# EAGLE design espnative-deadrail-2-c (EAGLE 7.6.0)
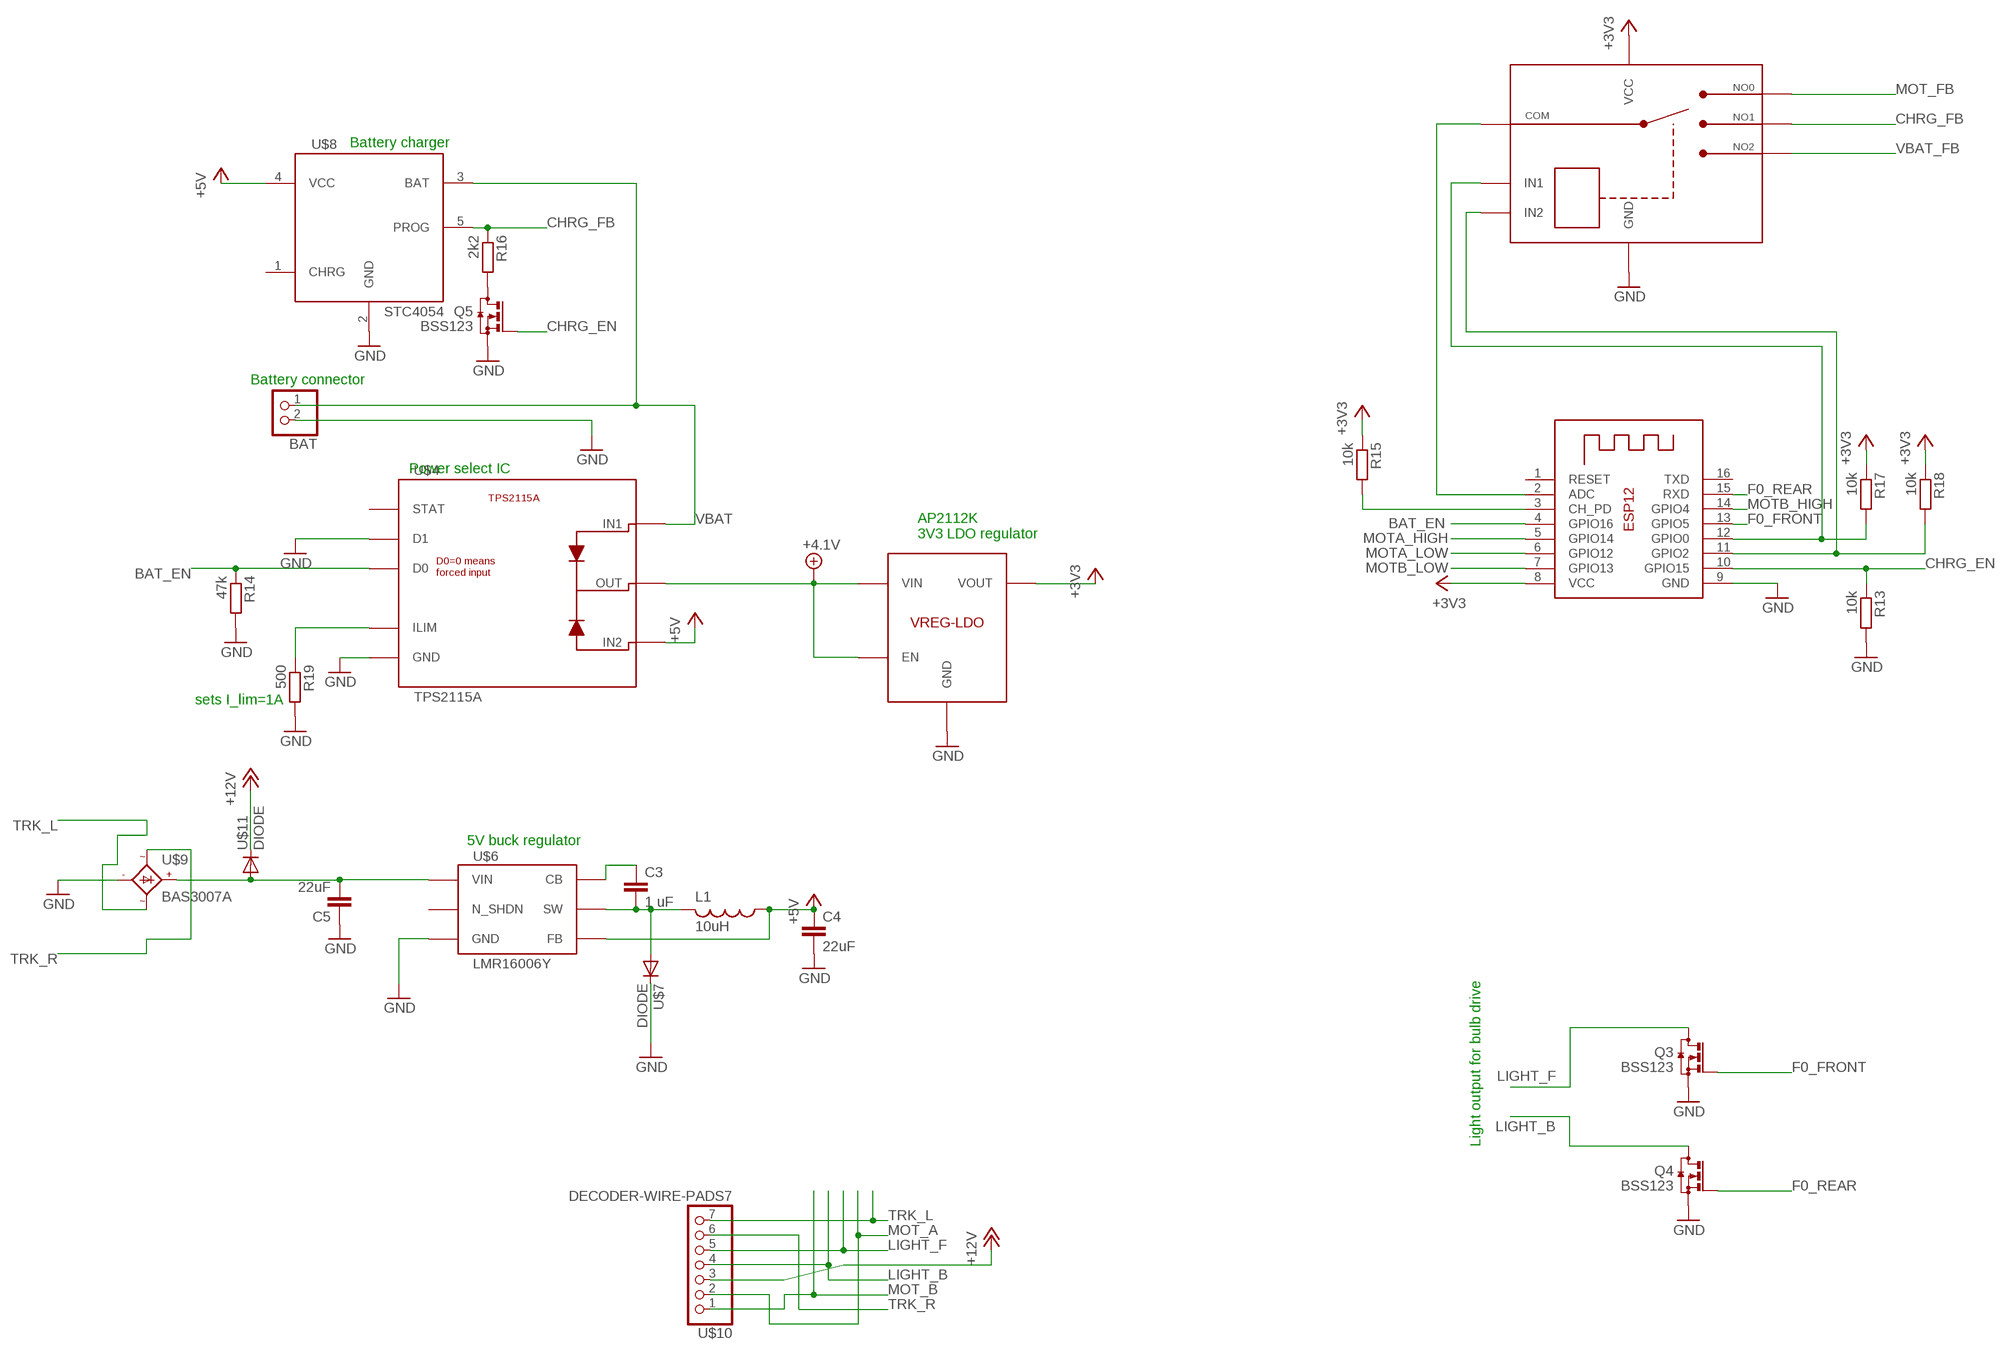
[diagram p0: schematic, sheet 1, part 1 of 2]
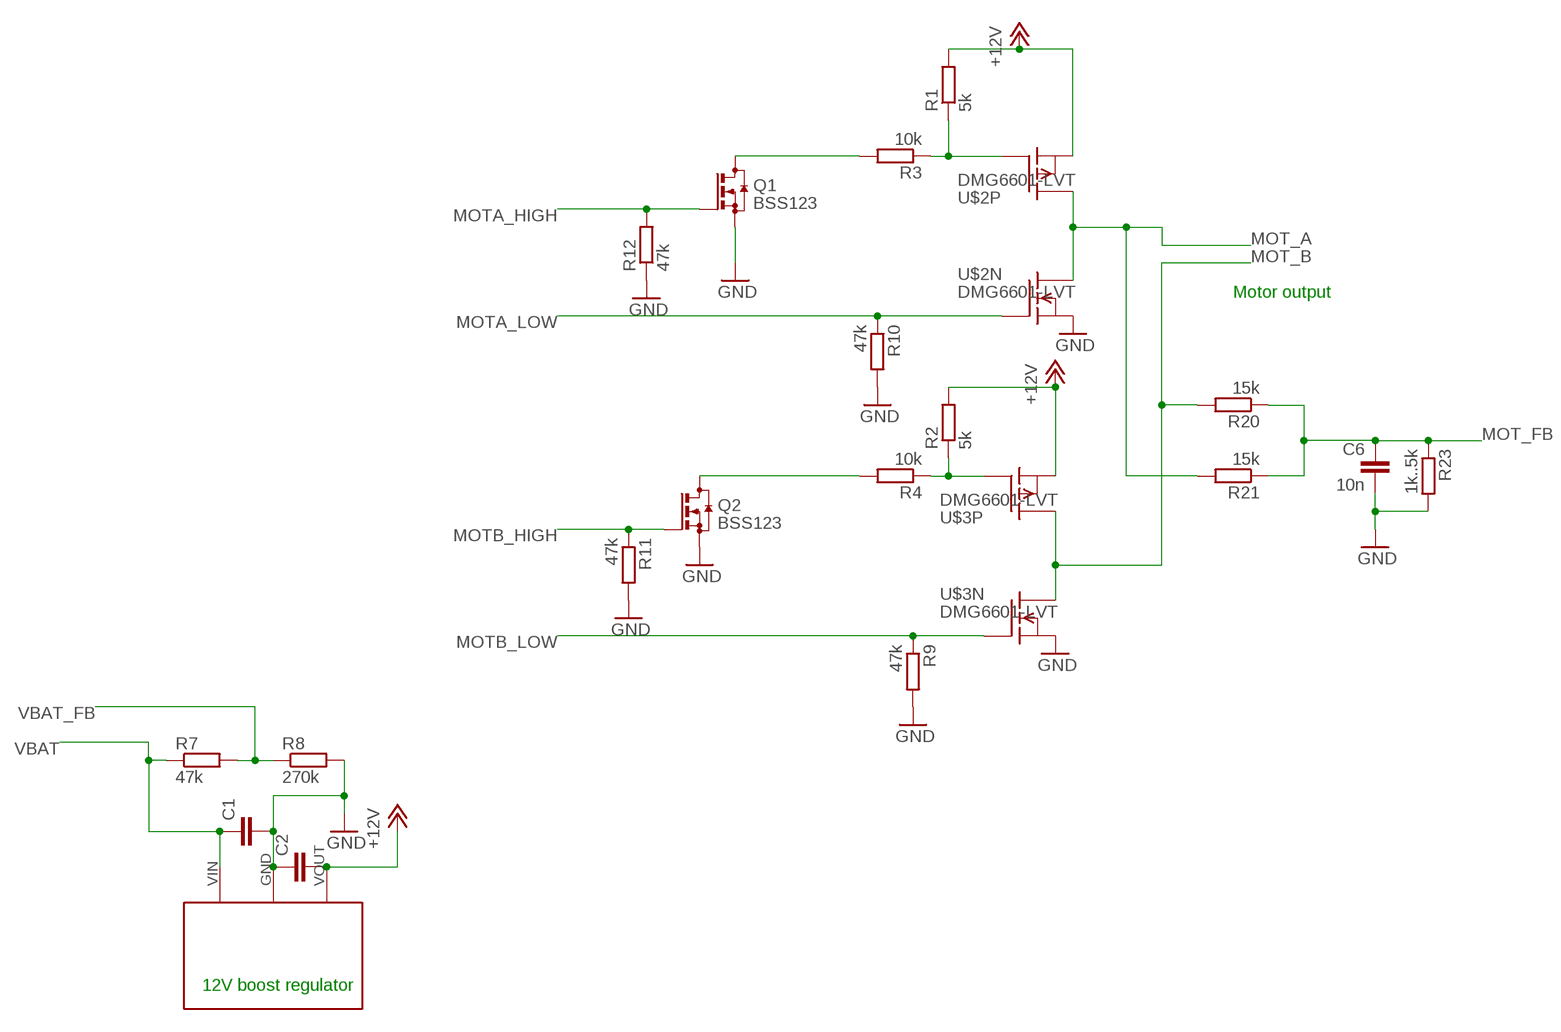
[diagram p1: schematic, sheet 1, part 2 of 2]

## Parts
BAT  JST_2PIN-SMT-RA  [JST-PH-2-SMT-RA]
C1  C-EUC1206  [C1206]
C2  C-EUC1206  [C1206]
C3  1 uF  C-EUC0603  [C0603]
C4  22uF  C-EUC0603  [C0603]
C5  22uF  C-EUC1206  [C1206]
C6  10n  C-EUC0603  [C0603]
L1  10uH  FDSD0420  [FDSD0420]
Q1  BSS123  [SOT23]
Q2  BSS123  [SOT23]
Q3  BSS123  [SOT23]
Q4  BSS123  [SOT23]
Q5  BSS123  [SOT23]
R1  5k  R-EU_R0603  [R0603]
R2  5k  R-EU_R0603  [R0603]
R3  10k  R-EU_R0603  [R0603]
R4  10k  R-EU_R0603  [R0603]
R7  47k  R-EU_R0603  [R0603]
R8  270k  R-EU_R0603  [R0603]
R9  47k  R-EU_R0603  [R0603]
R10  47k  R-EU_R0603  [R0603]
R11  47k  R-EU_R0603  [R0603]
R12  47k  R-EU_R0603  [R0603]
R13  10k  R-EU_R0603  [R0603]
R14  47k  R-EU_R0603  [R0603]
R15  10k  R-EU_R0603  [R0603]
R16  2k2  R-EU_R0603  [R0603]
R17  10k  R-EU_R0603  [R0603]
R18  10k  R-EU_R0603  [R0603]
R19  500  R-EU_R0603  [R0603]
R20  15k  R-EU_R0603  [R0603]
R21  15k  R-EU_R0603  [R0603]
R23  1k..5k  R-EU_R0603  [R0603]
U$1  AP2112K-3V3  AP2112K  [SOT23-5L]
U$2  DMG6601-LVT  [TSOT-26]
U$3  DMG6601-LVT  [TSOT-26]
U$4  TPS2115A  [TSSOP-8]
U$5  POLOLU-VREG12  [POLOLU-REGULATOR]
U$6  LMR16006Y  [SOT23-6]
U$7  DIODE  [DIODE-1206]
U$8  STC4054  [SOT23-5L]
U$9  BAS3007A  [SOT143B]
U$10  DECODER-WIRE-PADS7  [DECODER-WIRE-PADS]
U$11  DIODE  [DIODE-1206]
U$12  TS5A3359  [US8]
X1  ESP-12  [ESP-12]

## Nets
+3V3: R15.1 R17.1 R18.1 U$1.5(VOUT) U$12.8(VCC) X1.8(VCC)
+4.1V: U$1.1(VIN) U$1.3(EN) U$4.7(OUT)
+5V: C4.1 L1.P$1 U$4.6(IN2) U$6.3(FB) U$8.4(VCC)
+12V: C2.2 R1.2 R2.2 U$2.2(P:S) U$3.2(P:S) U$5.VOUT U$10.3 U$11.C
BAT_EN: R14.1 U$4.2(D0) X1.4(GPIO16)
CHRG_EN: Q5.1(G) R13.1 X1.10(GPIO15)
CHRG_FB: R16.1 U$8.5(PROG) U$12.2(NO1)
DCC_VPLUS: C5.2 U$6.5(VIN) U$9.4(+) U$11.A
F0_FRONT: Q3.1(G) X1.13(GPIO5)
F0_REAR: Q4.1(G) X1.15(RXD)
GND: BAT.2 C1.2 C2.1 C4.2 C5.1 C6.2 Q1.2(S) Q2.2(S) Q3.2(S) Q4.2(S) Q5.2(S) R8.2 R9.2 R10.2 R11.2 R12.1 R13.2 R14.2 R19.2 R23.2 U$1.2(GND) U$2.5(N:S) U$3.5(N:S) U$4.3(D1) U$4.5(GND) U$5.GND U$6.2(GND) U$7.C U$8.2(GND) U$9.1(-) U$12.4(GND) X1.9(GND)
LIGHT_B: Q4.3(D) U$10.4
LIGHT_F: Q3.3(D) U$10.5
MOT_A: R21.2 U$2.4(P:D) U$2.6(N:D) U$10.2
MOT_B: R20.2 U$3.4(P:D) U$3.6(N:D) U$10.1
MOT_FB: C6.1 R20.1 R21.1 R23.1 U$12.1(NO0)
MOTA_HIGH: Q1.1(G) R12.2 X1.5(GPIO14)
MOTA_LOW: R10.1 U$2.1(N:G) X1.6(GPIO12)
MOTB_HIGH: Q2.1(G) R11.1 X1.14(GPIO4)
MOTB_LOW: R9.1 U$3.1(N:G) X1.7(GPIO13)
N$1: U$12.7(COM) X1.2(ADC)
N$2: R1.1 R3.1 U$2.3(P:G)
N$3: Q2.3(D) R4.2
N$4: R2.1 R4.1 U$3.3(P:G)
N$5: C3.2 L1.P$2 U$6.6(SW) U$7.A
N$6: Q1.3(D) R3.2
N$8: C3.1 U$6.1(CB)
N$11: Q5.3(D) R16.2
N$12: R17.2 U$12.6(IN1) X1.12(GPIO0)
N$17: R15.2 X1.3(CH_PD)
N$20: R18.2 U$12.5(IN2) X1.11(GPIO2)
N$22: R19.1 U$4.4(ILIM)
TRK_L: U$9.3(AC2) U$10.7
TRK_R: U$9.2(AC1) U$10.6
VBAT: BAT.1 C1.1 R7.1 U$4.8(IN1) U$5.VIN U$8.3(BAT)
VBAT_FB: R7.2 R8.1 U$12.3(NO2)
Unconnected: U$4.1(STAT) U$6.4(N_SHDN) U$8.1(CHRG) X1.1(RESET) X1.16(TXD)

## Notes on the sheet
- Battery charger
- Battery connector
- Power select IC
- AP2112K
  3V3 LDO regulator
- Motor output
- sets I_lim=1A
- 5V buck regulator
- Light output for bulb drive
- 12V boost regulator

## Library data of the parts
BAT = adafruit:JST_2PIN: JST 2-Pin Connectors of various flavors SMT-RA (S2B-PH-SM4) 4UConnector #17311 SMT (B2B-PH-SM4) THM-RA (S2B-PH) THM (B2B-PH)
C1-C6 = rcl:C-EU: CAPACITOR, European symbol
L1 = trainlib:FDSD0420
Q1-Q5 = transistor-small-signal:BSS123: N-CHANNEL MOS FET
R1-R4 R7-R21 R23 = rcl:R-EU_: RESISTOR, European symbol
U$1 = trainlib:AP2112: 600mA CMOS LDO regulator with enable http://www.diodes.com/_files/datasheets/AP2112.pdf http://www.digikey.com/product-detail/en/diodes-incorporated/AP2112K-3.3TRG1/AP2112K-3.3TRG1DICT-ND/4505257 Package includes sot23-5.
U$2 U$3 = trainlib:DMG6601-LVT: Dual N+P-channel MOSFET. Package: TSOT-26 Vmax=30V N-channel: 55mOhm, 3.8A Imax P-channel: 110mOhm, 2.5A Imax
U$4 = trainlib:TPS2115A: Power source select Ideal diode pair selects power source from two alternatives. Truth table: D0=0 selects fixed input. (D1=0 sleects IN2, D1=1 selects IN1) D0=1 selects auto-input. (D1=0 picks higher voltage, D1=1 sets shutdown) http://www.ti.com/lit/ds/symlink/tps2114a.pdf
U$5 = trainlib:POLOLU-VREG12
U$6 = trainlib:LMR16006Y: Buck regulator with 600mA output current and 2.1MHz fixed frequency. http://www.ti.com/lit/ds/symlink/lmr16006y-q1.pdf Available in sot23-6 package.
U$7 U$11 = trainlib:DIODE
U$8 = trainlib:STC4054: Single-cell Li-ion battery charger Configurable maximum current Lithium battery charger. The maximum charging current can be configured with a resistor, up to 800 mA. Charge can be enabled or inhibited. http://www.st.com/content/ccc/resource/technical/document/datasheet/df/b9/e6/5b/ec/92/45/ed/CD00132951.pdf/files/CD00132951.pdf/jcr:content/translations/en.CD00132951.pdf
U$9 = trainlib:BAS3007A: Bridge rectifier 30V typical voltage loss 0.5V, current capability up to 0.9A datasheet link <http://www.infineon.com/dgdl/bas3007aseries.pdf?folderId=db3a304313d846880113def5812204a1&fileId=db3a3043156fd5730115a286aa19083b>
U$10 = trainlib:DECODER-WIRE-PADS7
U$12 = trainlib:TS5A3359: SP3T analog mux 1-Ohm 3-way multiplexer, controlled by two input lines. http://www.ti.com/lit/ds/symlink/ts5a3359.pdf
X1 = adafruit:ESP-12

## Board
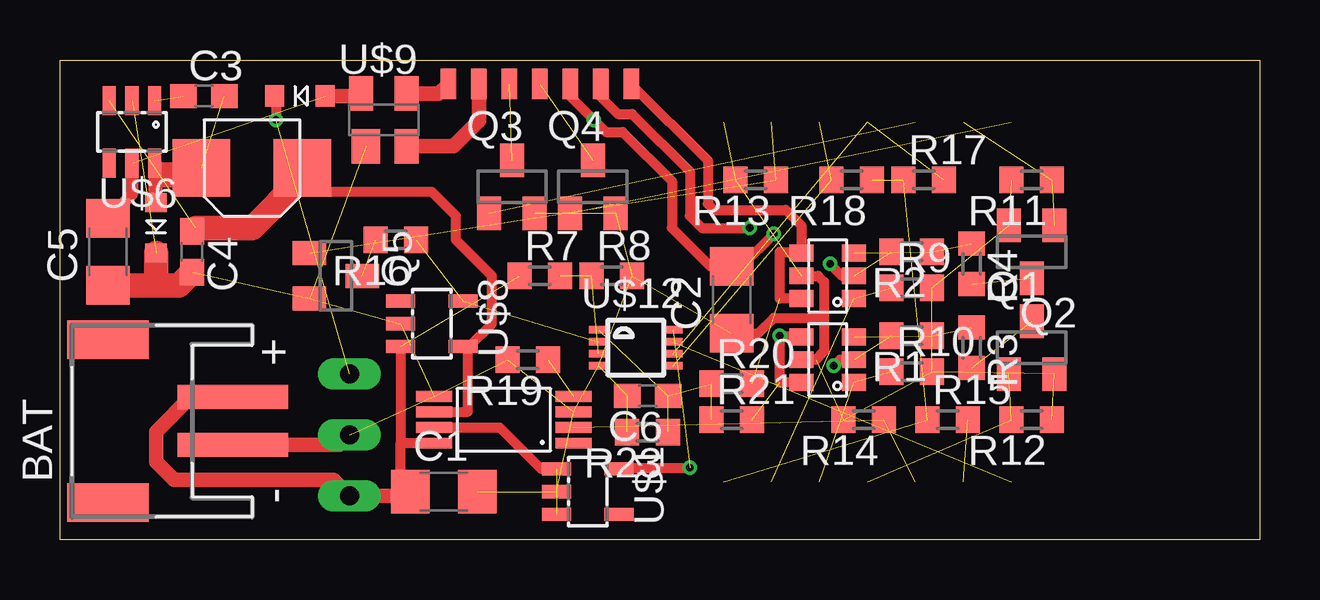
[diagram p2: board, top side]
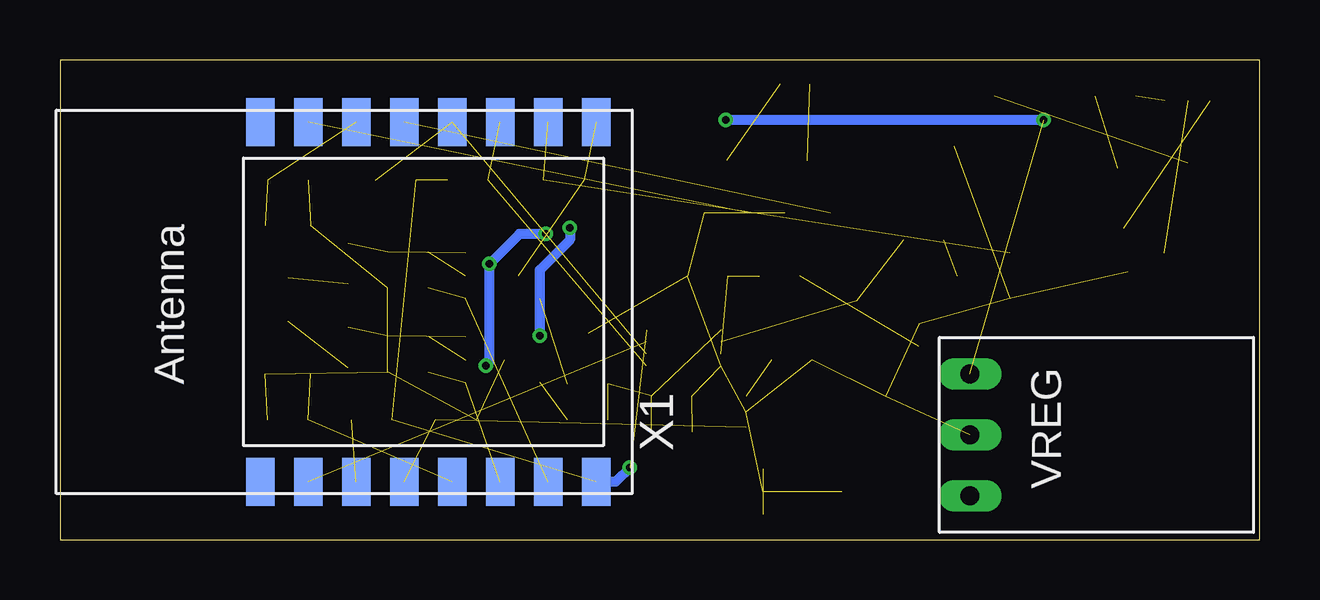
[diagram p3: board, bottom side, seen from below]

Size 50 x 20 mm. Coordinates in mm from the lower left corner, seen from the top.
Outline: 0,0 0,20 50,20 50,0 0,0
Copper layers (1*16): Top 0.035mm / dielectric 1.5mm / Bottom 0.035mm
Design rules "Fusion_eagle_rule_v1.1": minimum track width 6mil, minimum drill 12mil, track to track 6mil, track to pad 6mil, pad to pad 6mil, via to via 6mil, smd to smd 0mil, copper to edge 10mil, drill to drill 10mil, minimum pad ring 10mil, minimum via ring 6mil, stop-mask expansion 2mil, vias tented up to drill 100mil, thermal gap 10mil

### Footprints (pad centres in the part's own frame; a part is rotated, then mirrored left to right if it is on the bottom)
JST-PH-2-SMT-RA = smd 1 x 4.6: 1 1,-3.7; 2 -1,-3.7 | smd 1.6 x 3.4: NC1 -3.4,1.5; NC2 3.4,1.5
C1206 = smd 1.6 x 1.8: 1 -1.4,0; 2 1.4,0
C0603 = smd 1.1 x 1: 1 -0.85,0; 2 0.85,0
FDSD0420 = smd 2.4 x 2.4: P$1 -2.1,0; P$2 2.1,0
SOT23 = smd 1 x 1.4: 1 -0.95,-1.1; 2 0.95,-1.1; 3 0,1.1
R0603 = smd 1 x 1.1: 1 -0.85,0; 2 0.85,0
SOT23-5L = smd 0.55 x 1.2: 1 -0.95,-1.3; 2 0,-1.3; 3 0.95,-1.3; 4 0.95,1.3; 5 -0.95,1.3
TSOT-26 = smd 0.7 x 1: 1 -0.95,-1.1; 2 0,-1.1; 3 0.95,-1.1; 4 0.95,1.1; 5 0,1.1; 6 -0.95,1.1
TSSOP-8 = smd 1.5 x 0.45: 1 -2.9,0.975; 2 -2.9,0.325; 3 -2.9,-0.325; 4 -2.9,-0.975; 5 2.9,-0.975; 6 2.9,-0.325; 7 2.9,0.325; 8 2.9,0.975
POLOLU-REGULATOR = drill 0.8 long: GND 4.064,1.27; VIN 6.604,1.27; VOUT 1.524,1.27
SOT23-6 = smd 0.55 x 1.2: 1 -0.95,-1.3; 2 0,-1.3; 3 0.95,-1.3; 4 0.95,1.3; 5 0,1.3; 6 -0.95,1.3
DIODE-1206 = smd 0.8 x 0.9: A 1.05,0; C -1.05,0
SOT143B = smd 1.2 x 1.44: 1 -0.75,-1.1 | smd 1 x 1.44: 2 0.95,-1.1; 3 0.95,1.1; 4 -0.95,1.1
DECODER-WIRE-PADS = smd 1.27 x 0.635: 1 0,3.81; 2 0,2.54; 3 0,1.27; 4 0,0; 5 0,-1.27; 6 0,-2.54; 7 0,-3.81
US8 = smd 0.3 x 0.8: 1 -0.75,-1.55; 2 -0.25,-1.55; 3 0.25,-1.55; 4 0.75,-1.55; 5 0.75,1.55; 6 0.25,1.55; 7 -0.25,1.55; 8 -0.75,1.55
ESP-12 = smd 2 x 1.2: 1 -7.5,4.5; 2 -7.5,2.5; 3 -7.5,0.5; 4 -7.5,-1.5; 5 -7.5,-3.5; 6 -7.5,-5.5; 7 -7.5,-7.5; 8 -7.5,-9.5; 9 7.5,-9.5; 10 7.5,-7.5; 11 7.5,-5.5; 12 7.5,-3.5; 13 7.5,-1.5; 14 7.5,0.5; 15 7.5,2.5; 16 7.5,4.5

### Placement (x,y rotation side)
BAT  3.5,4.94 90 top
C1  16,2 0 top
C2  28,10 90 top
C3  6,18.5 0 top
C4  5.5,12 270 top
C5  2,12 90 top
C6  24.5,6 180 top
L1  8,15.5 180 top
Q1  40.5,8 0 top
Q2  40.5,12 180 top
Q3  18.84,14.71 0 top
Q4  22.21,14.71 0 top
Q5  11.5,11 270 top
R1  35.5,8.5 180 top
R2  35.5,12 180 top
R3  38,8 270 top
R4  38,11.5 270 top
R7  20,11 0 top
R8  23,11 0 top
R9  35.5,10.5 0 top
R10  35.5,7 0 top
R11  40.5,15 180 top
R12  40.5,5 180 top
R13  29,15 180 top
R14  33.5,5 180 top
R15  37,5 0 top
R16  14,12.5 180 top
R17  36,15 0 top
R18  33,15 180 top
R19  19.5,7.5 180 top
R20  28,6.5 0 top
R21  28,5 0 top
R23  24.49,4.48 180 top
U$1  22,2 270 top
U$2  32,7.5 90 top
U$3  32,11 90 top
U$4  18.5,5 180 top
U$5  13.34,8.43 270 bottom
U$6  3,17 180 top
U$7  4,13 90 top
U$8  15.5,9 270 top
U$9  13.5,17.5 0 top
U$10  20,19 270 top
U$11  10,18.5 0 top
U$12  24,8 270 top
X1  37.15,9.91 90 bottom

### Tracks (layer width: path | path; a pad name or v marks a point on that pad's centre or on a via)
+3V3  (via drill 0.3)  (4 unrouted)
  Top 0.406: U$1.5 23.35,3 v26.25,3
  Bottom 0.406: v26.25,3 26.84,2.41 X1.8
+4.1V  (1 unrouted)
  Top 0.406: U$4.7 18.32,4.67 20.05,2.95 U$1.1
+5V  (1 unrouted)
  Top 0.406: U$4.6 17,5.33 17,8.05 U$8.4 17.05,8.05 18,9 18,11 16.5,12.5 16.5,13.5 15.5,14.5 11.1,14.5 L1.P$1
  Top 1.016: C4.1 5.65,13 8,13 10.1,15.1 L1.P$1
+12V  (via drill 0.3)  (3 unrouted)
  Top 0.406: v29.75,12.75 28.4,11.4 C2.2 27.1,11.4 25.5,13 25.5,14.95 23.45,17 22.75,17 v22.25,17.5 22.12,17.62 21.27,18.48 U$10.3 | v32.1,11.5 32.6,11 U$3.2 | U$2.2 32.5,7.5 v32.25,7.25 | U$11.C 9,18.45 v9,17.5
  Bottom 0.406: v29.75,12.75 30.85,12.75 v32.1,11.5 32.1,7.4 v32.25,7.25 | v9,17.5 v22.25,17.5
BAT_EN  (2 unrouted)
CHRG_EN  (2 unrouted)
CHRG_FB  (2 unrouted)
DCC_VPLUS  (1 unrouted)
  Top 0.508: U$6.5 3,14.4 C5.2
  Top 0.61: U$9.4 12.45,18.5 U$11.A
F0_FRONT  (1 unrouted)
F0_REAR  (1 unrouted)
GND  (26 unrouted)
  Top 0.406: C2.1 29.1,8.6 29.75,9.25 31.85,9.25 | 31.85,9.25 31.85,7.85 31.5,7.5 U$2.5 | U$3.5 31.6,11 31.85,10.75 31.85,9.25
  Top 0.61: BAT.2 11.64,3.94 U$5.GND
  Top 1.016: C4.2 4.95,10.6 4,10.6 | 4,10.6 C5.1 | U$7.C 4,10.6
LIGHT_B  (1 unrouted)
LIGHT_F  (1 unrouted)
MOT_A  (via drill 0.3)  (1 unrouted)
  Top 0.406: U$2.6 30,6.55 v30,8.5 30.9,8.5 U$2.4 | U$10.2 22.54,18.46 23.25,17.75 23.85,17.75 26.25,15.35 26.25,13.5 26.75,13 v28.75,13
  Bottom 0.406: v28.75,13 28.75,12.5 30,11.25 v30,8.5
MOT_B  (1 unrouted)
  Top 0.406: U$3.6 30,10.05 30,12 30.9,12 U$3.4 30.9,13.1 30.25,13.75 27.25,13.75 27,14 27,15.81 U$10.1
MOT_FB  (4 unrouted)
MOTA_HIGH  (2 unrouted)
MOTA_LOW  (2 unrouted)
MOTB_HIGH  (2 unrouted)
MOTB_LOW  (2 unrouted)
N$1  (1 unrouted)
N$2  (2 unrouted)
N$3  (1 unrouted)
N$4  (2 unrouted)
N$5  (1 unrouted)
  Top 0.508: U$7.A 3.95,14.1 U$6.6 4.15,15.5 L1.P$2 5.4,15 | 4,15 4,14
  Top 0.61: 5.4,15 4,15
N$6  (1 unrouted)
N$8  (1 unrouted)
N$11  (1 unrouted)
N$12  (2 unrouted)
N$17  (1 unrouted)
N$20  (2 unrouted)
N$22  (1 unrouted)
TRK_L
  Top 0.61: U$9.3 15.79,18.6 U$10.7
TRK_R
  Top 0.61: U$9.2 16.4,16.4 17.46,17.46 U$10.6
VBAT  (1 unrouted)
  Top 0.406: U$8.3 14.2,4.03 | 14.2,4.03 U$4.8 | C1.1 14.2,2 14.2,4.03
  Top 0.61: BAT.1 5.44,5.94 4,4.5 4,3.25 4.75,2.5 11.4,2.5 U$5.VIN 14.43,1.83 C1.1
VBAT_FB  (2 unrouted)